# EAGLE schematic El_Sequencer_Board (EAGLE 7.0.0)
ERSTELLER: Marco Schmandt
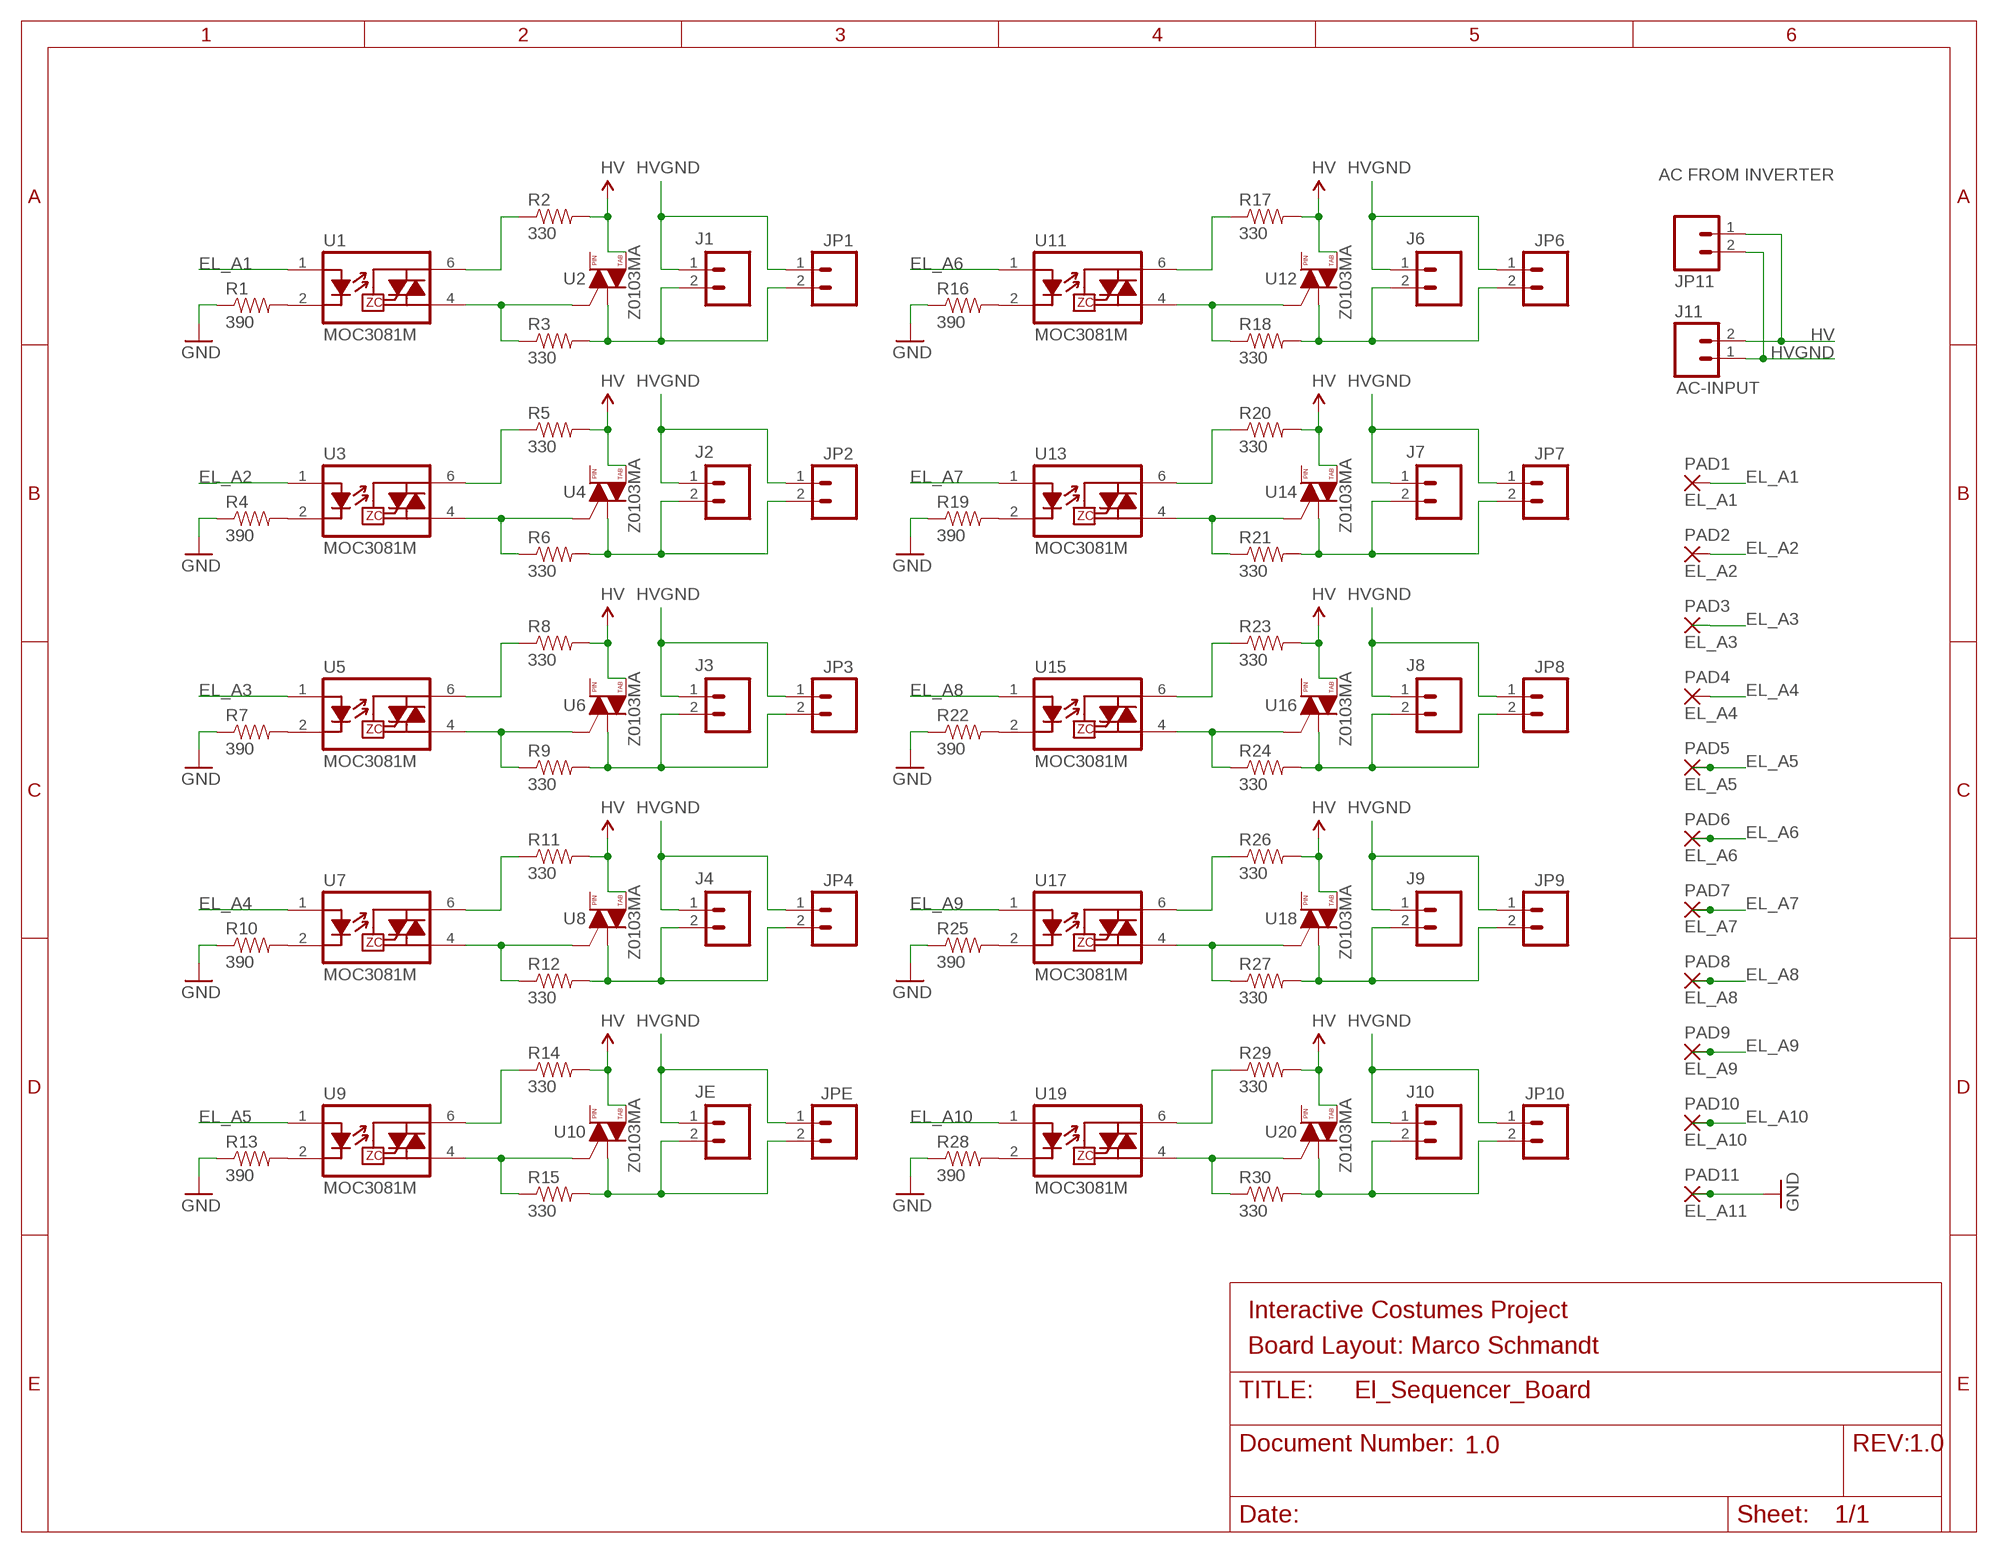
[diagram p0: schematic, sheet 1]

## Parts
J1  M02-JST-2MM-SMT  [JST-2-SMD]
J2  M02-JST-2MM-SMT  [JST-2-SMD]
J3  M02-JST-2MM-SMT  [JST-2-SMD]
J4  M02-JST-2MM-SMT  [JST-2-SMD]
J6  M02-JST-2MM-SMT  [JST-2-SMD]
J7  M02-JST-2MM-SMT  [JST-2-SMD]
J8  M02-JST-2MM-SMT  [JST-2-SMD]
J9  M02-JST-2MM-SMT  [JST-2-SMD]
J10  M02-JST-2MM-SMT  [JST-2-SMD]
J11  AC-INPUT  M02-JST-2MM-SMT  [JST-2-SMD]
JE  M02-JST-2MM-SMT  [JST-2-SMD]
JP1  M02PTH  [1X02]
JP2  M02PTH  [1X02]
JP3  M02PTH  [1X02]
JP4  M02PTH  [1X02]
JP6  M02PTH  [1X02]
JP7  M02PTH  [1X02]
JP8  M02PTH  [1X02]
JP9  M02PTH  [1X02]
JP10  M02PTH  [1X02]
JP11  M02PTH  [1X02]
JPE  M02PTH  [1X02]
PAD1  EL_A1  WIREPADSMD5-2,5  [5-2,5]
PAD2  EL_A2  WIREPADSMD5-2,5  [5-2,5]
PAD3  EL_A3  WIREPADSMD5-2,5  [5-2,5]
PAD4  EL_A4  WIREPADSMD5-2,5  [5-2,5]
PAD5  EL_A5  WIREPADSMD5-2,5  [5-2,5]
PAD6  EL_A6  WIREPADSMD5-2,5  [5-2,5]
PAD7  EL_A7  WIREPADSMD5-2,5  [5-2,5]
PAD8  EL_A8  WIREPADSMD5-2,5  [5-2,5]
PAD9  EL_A9  WIREPADSMD5-2,5  [5-2,5]
PAD10  EL_A10  WIREPADSMD5-2,5  [5-2,5]
PAD11  EL_A11  WIREPADSMD5-2,5  [5-2,5]
R1  390  RESISTOR0402-RES  [0402-RES]
R2  330  RESISTOR0603-RES  [0603-RES]
R3  330  RESISTOR0603-RES  [0603-RES]
R4  390  RESISTOR0402-RES  [0402-RES]
R5  330  RESISTOR0603-RES  [0603-RES]
R6  330  RESISTOR0603-RES  [0603-RES]
R7  390  RESISTOR0402-RES  [0402-RES]
R8  330  RESISTOR0603-RES  [0603-RES]
R9  330  RESISTOR0603-RES  [0603-RES]
R10  390  RESISTOR0402-RES  [0402-RES]
R11  330  RESISTOR0603-RES  [0603-RES]
R12  330  RESISTOR0603-RES  [0603-RES]
R13  390  RESISTOR0402-RES  [0402-RES]
R14  330  RESISTOR0603-RES  [0603-RES]
R15  330  RESISTOR0603-RES  [0603-RES]
R16  390  RESISTOR0402-RES  [0402-RES]
R17  330  RESISTOR0603-RES  [0603-RES]
R18  330  RESISTOR0603-RES  [0603-RES]
R19  390  RESISTOR0402-RES  [0402-RES]
R20  330  RESISTOR0603-RES  [0603-RES]
R21  330  RESISTOR0603-RES  [0603-RES]
R22  390  RESISTOR0402-RES  [0402-RES]
R23  330  RESISTOR0603-RES  [0603-RES]
R24  330  RESISTOR0603-RES  [0603-RES]
R25  390  RESISTOR0402-RES  [0402-RES]
R26  330  RESISTOR0603-RES  [0603-RES]
R27  330  RESISTOR0603-RES  [0603-RES]
R28  390  RESISTOR0402-RES  [0402-RES]
R29  330  RESISTOR0603-RES  [0603-RES]
R30  330  RESISTOR0603-RES  [0603-RES]
U1  MOC3081M  MOC3063S  [DIP8SMD]
U2  Z0103MA  TRIACSMD  [SOT223]
U3  MOC3081M  MOC3063S  [DIP8SMD]
U4  Z0103MA  TRIACSMD  [SOT223]
U5  MOC3081M  MOC3063S  [DIP8SMD]
U6  Z0103MA  TRIACSMD  [SOT223]
U7  MOC3081M  MOC3063S  [DIP8SMD]
U8  Z0103MA  TRIACSMD  [SOT223]
U9  MOC3081M  MOC3063S  [DIP8SMD]
U10  Z0103MA  TRIACSMD  [SOT223]
U11  MOC3081M  MOC3063S  [DIP8SMD]
U12  Z0103MA  TRIACSMD  [SOT223]
U13  MOC3081M  MOC3063S  [DIP8SMD]
U14  Z0103MA  TRIACSMD  [SOT223]
U15  MOC3081M  MOC3063S  [DIP8SMD]
U16  Z0103MA  TRIACSMD  [SOT223]
U17  MOC3081M  MOC3063S  [DIP8SMD]
U18  Z0103MA  TRIACSMD  [SOT223]
U19  MOC3081M  MOC3063S  [DIP8SMD]
U20  Z0103MA  TRIACSMD  [SOT223]

## Nets
EL_A1: PAD1.1(P) U1.1(A)
EL_A2: PAD2.1(P) U3.1(A)
EL_A3: PAD3.1(P) U5.1(A)
EL_A4: PAD4.1(P) U7.1(A)
EL_A5: PAD5.1(P) U9.1(A)
EL_A6: PAD6.1(P) U11.1(A)
EL_A7: PAD7.1(P) U13.1(A)
EL_A8: PAD8.1(P) U15.1(A)
EL_A9: PAD9.1(P) U17.1(A)
EL_A10: PAD10.1(P) U19.1(A)
GND: PAD11.1(P) R1.1 R4.1 R7.1 R10.1 R13.1 R16.1 R19.1 R22.1 R25.1 R28.1
HV: J11.2 JP11.1 R2.2 R5.2 R8.2 R11.2 R14.2 R17.2 R20.2 R23.2 R26.2 R29.2 U2.4(T2) U4.4(T2) U6.4(T2) U8.4(T2) U10.4(T2) U12.4(T2) U14.4(T2) U16.4(T2) U18.4(T2) U20.4(T2)
HVGND: J1.1 J2.1 J3.1 J4.1 J6.1 J7.1 J8.1 J9.1 J10.1 J11.1 JE.1 JP1.1 JP2.1 JP3.1 JP4.1 JP6.1 JP7.1 JP8.1 JP9.1 JP10.1 JP11.2 JPE.1
N$1: R6.1 U3.4(T2) U4.3(G)
N$2: R4.2 U3.2(K)
N$3: R5.1 U3.6(T1)
N$4: J2.2 JP2.2 R6.2 U4.1(T1)
N$5: R9.1 U5.4(T2) U6.3(G)
N$6: R7.2 U5.2(K)
N$7: R8.1 U5.6(T1)
N$8: J3.2 JP3.2 R9.2 U6.1(T1)
N$9: R12.1 U7.4(T2) U8.3(G)
N$10: R10.2 U7.2(K)
N$11: R11.1 U7.6(T1)
N$12: J4.2 JP4.2 R12.2 U8.1(T1)
N$13: R15.1 U9.4(T2) U10.3(G)
N$14: R13.2 U9.2(K)
N$15: R14.1 U9.6(T1)
N$16: JE.2 JPE.2 R15.2 U10.1(T1)
N$17: R18.1 U11.4(T2) U12.3(G)
N$18: R16.2 U11.2(K)
N$19: R17.1 U11.6(T1)
N$20: J6.2 JP6.2 R18.2 U12.1(T1)
N$21: R21.1 U13.4(T2) U14.3(G)
N$22: R3.1 U1.4(T2) U2.3(G)
N$23: R1.2 U1.2(K)
N$24: R2.1 U1.6(T1)
N$25: J1.2 JP1.2 R3.2 U2.1(T1)
N$26: R19.2 U13.2(K)
N$27: R20.1 U13.6(T1)
N$28: J7.2 JP7.2 R21.2 U14.1(T1)
N$29: R24.1 U15.4(T2) U16.3(G)
N$30: R22.2 U15.2(K)
N$31: R23.1 U15.6(T1)
N$32: J8.2 JP8.2 R24.2 U16.1(T1)
N$33: R27.1 U17.4(T2) U18.3(G)
N$34: R25.2 U17.2(K)
N$35: R26.1 U17.6(T1)
N$36: J9.2 JP9.2 R27.2 U18.1(T1)
N$37: R30.1 U19.4(T2) U20.3(G)
N$38: R28.2 U19.2(K)
N$39: R29.1 U19.6(T1)
N$40: J10.2 JP10.2 R30.2 U20.1(T1)
Unconnected: U2.2(T2) U4.2(T2) U6.2(T2) U8.2(T2) U10.2(T2) U12.2(T2) U14.2(T2) U16.2(T2) U18.2(T2) U20.2(T2)

## Notes on the sheet
- AC FROM INVERTER
- Interactive Costumes Project
- Board Layout: Marco Schmandt
- 1.0 | 1.0

## Library data of the parts
J1-J4 J6-J11 JE JP1-JP4 JP6-JP11 JPE = SparkFun:M02: Header 2 Standard 2-pin 0.1" header. Use with straight break away headers (SKU : PRT-00116), right angle break away headers (PRT-00553), swiss pins (PRT-00743), machine pins (PRT-00117), and female headers (PRT-00115). Molex polarized connector foot print use with SKU : PRT-08233 with associated crimp pins and housings.
PAD1-PAD11 = wirepad:WIREPAD: Wire PAD connect wire on PCB
R1-R30 = SparkFun:RESISTOR: Resistor Basic schematic elements and footprints for 0603, 1206, and PTH resistors.
U1 U3 U5 U7 U9 U11 U13 U15 U17 U19 = mike-temp:MOC3063*: Optotriac in DIP and SMD LED: Vf: 1.2V If: 5 mA TRIAC Vdrm: 600V Itsm: 1A Viso: 5000V DV/dt: 1500V/us DIP: MOC3063 SMD: MOC3063S
U2 U4 U6 U8 U10 U12 U14 U16 U18 U20 = mike-temp:TRIAC

## Net classes
0 Default: width 0.203 mm